# EasyEDA Pro project ProPrj_red-panda-afm_2025-05-21.epro, board PCB3
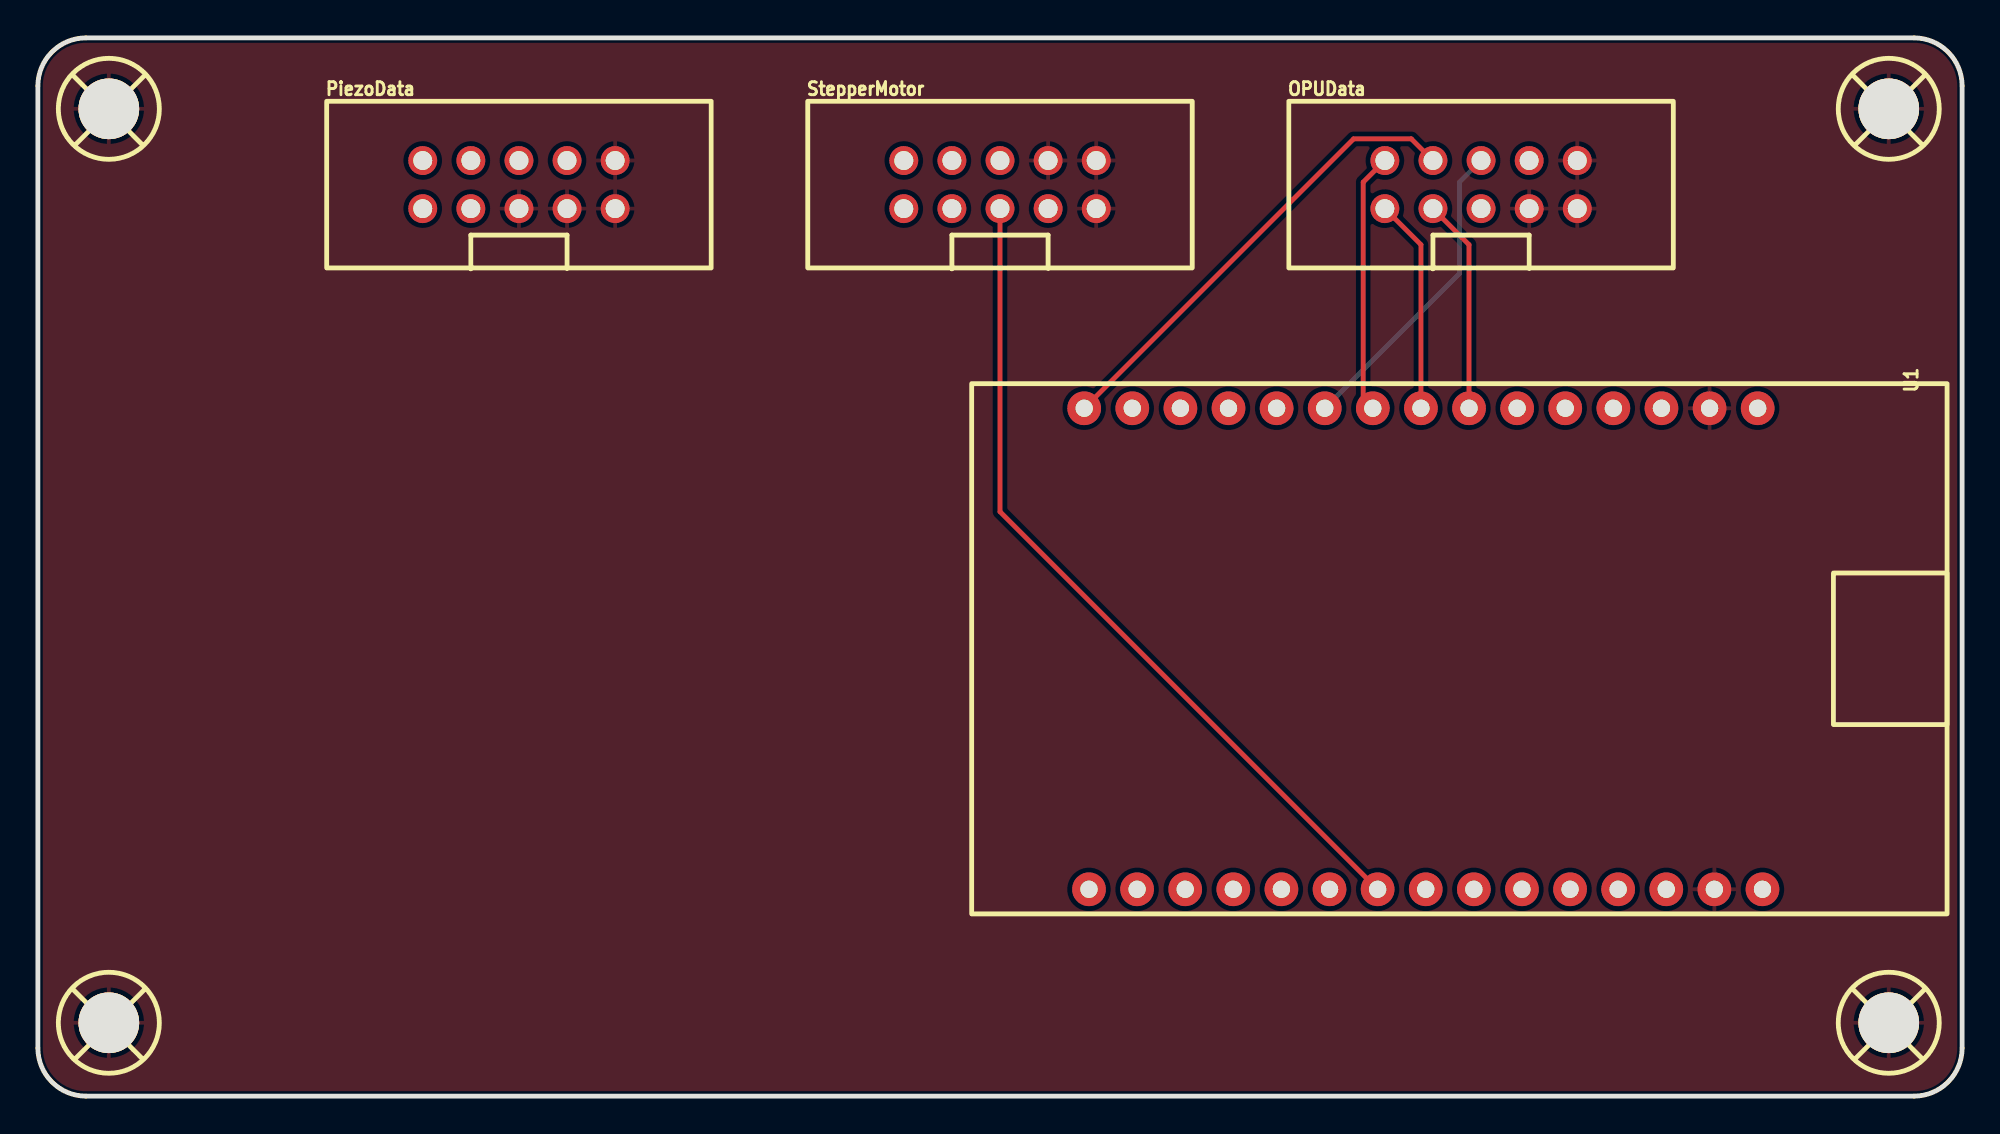
[diagram p12: board, top side]
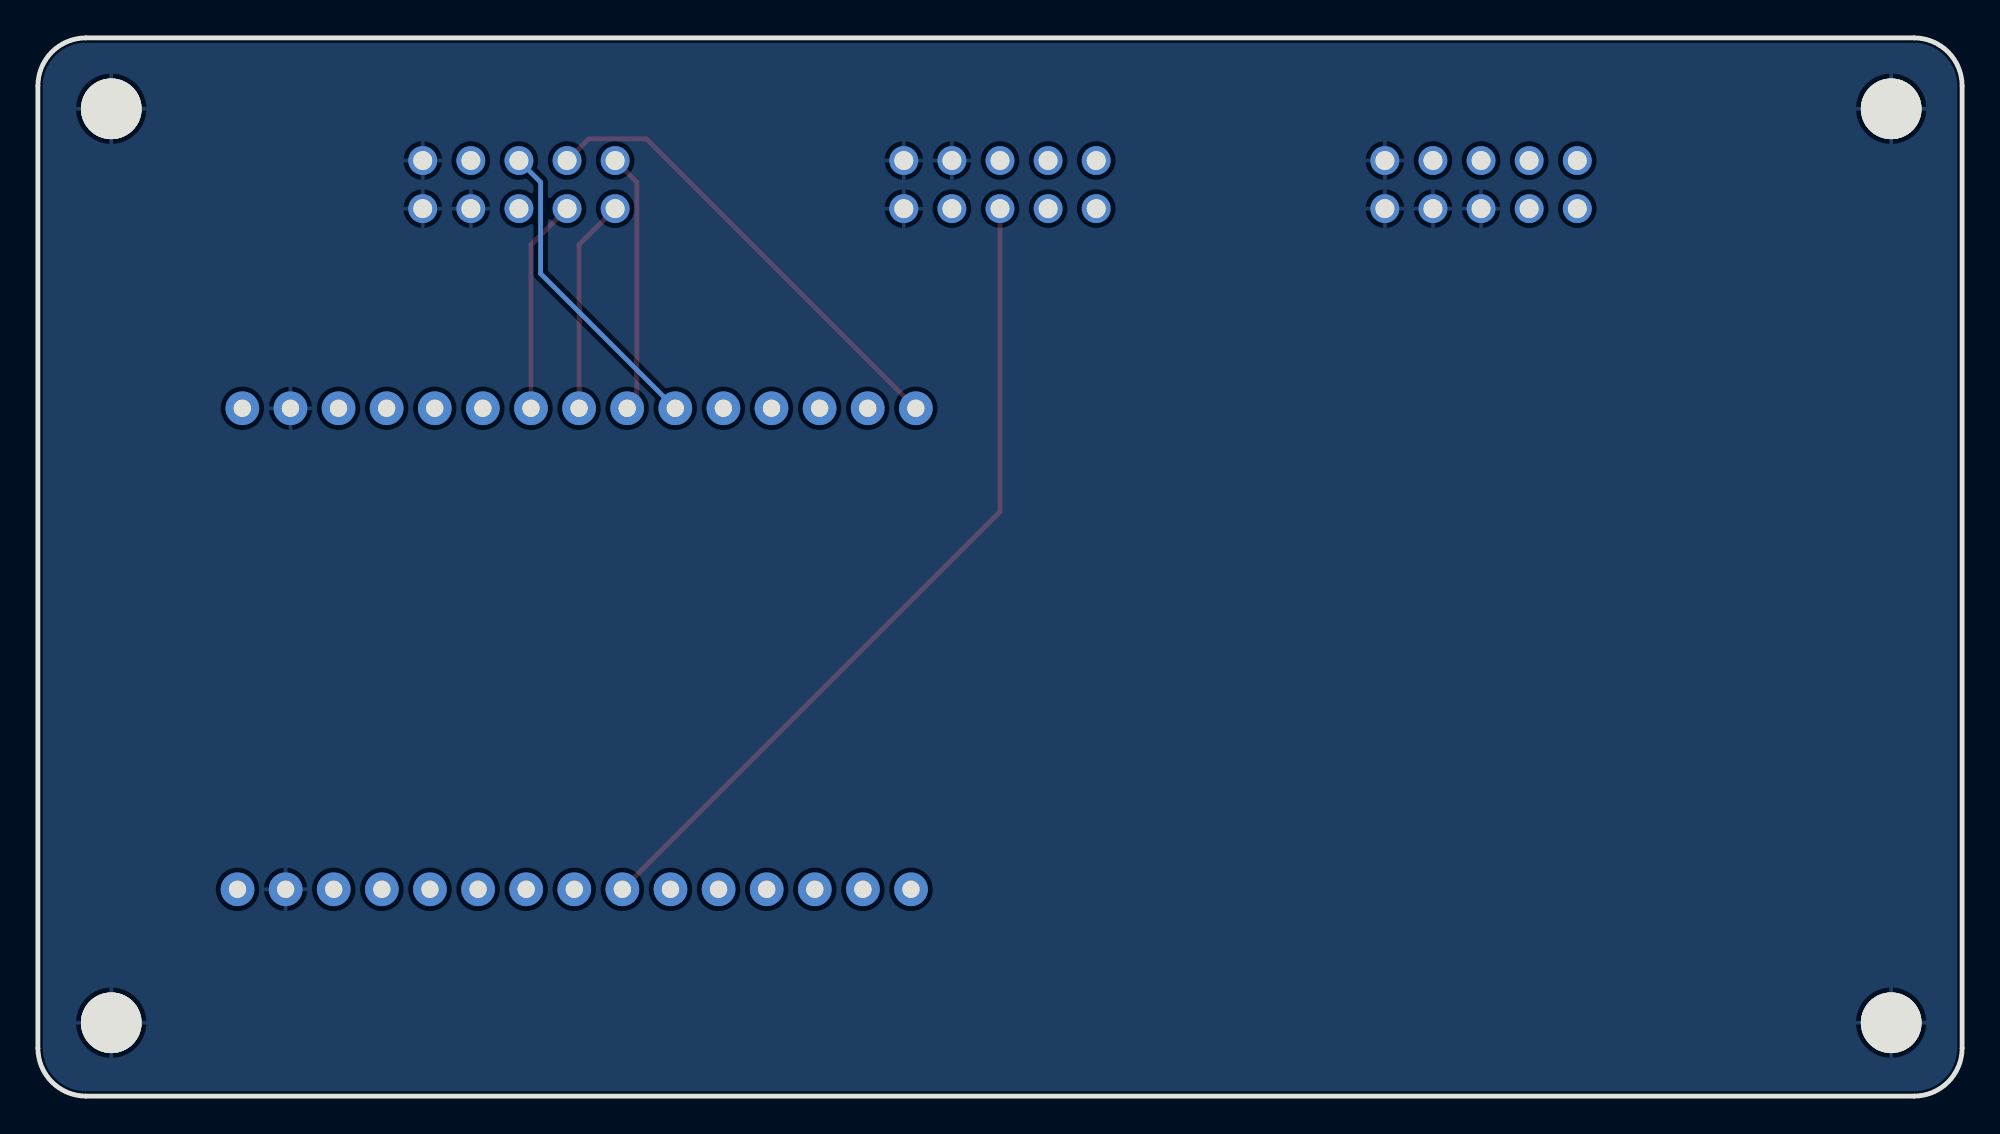
[diagram p13: board, bottom side, seen from below]

Outline 101.6 x 55.88 mm; copper layers: Top Layer, Inner1, Inner2, Bottom Layer. Coordinates in mm from the lower left corner of the outline.
Outline path: 0,53.34 0,2.54 arc(0.74,0.74) 2.54,0 99.06,0 arc(100.86,0.74) 101.6,2.54 101.6,53.34 arc(100.86,55.14) 99.06,55.88 2.54,55.88 arc(0.74,55.14) 0,53.34
Stack: Top Layer 0.035mm Outer layer copper thickness 1oz / Dielectric1 0.2104mm 7628 RC49% 8.6mil / Inner1 0.0152mm Inner layer copper thickness / Dielectric2 1.065mm 1.1mm H/HOZ Copper / Inner2 0.0152mm Inner layer copper thickness / Dielectric3 0.2104mm 7628 RC49% 8.6mil / Bottom Layer 0.035mm Outer layer copper thickness 1oz

## Design rules (mm)
template: JLCPCB Capability(Two Layers Board)
spacing copperThickness1oz (default): track to track 0.102, other pairs 0.152 to 0.3
spacing copperThickness2oz: track to track 0.203, other pairs 0.152 to 0.3
track width copperThickness1oz (default): min 0.127, default 0.254, max 2.54
track width copperThickness2oz: min 0.203, default 0.254, max 2.54
differential pair differentialPair (default): width min 0.127, default 0.254, max 2.54; gap min 0.152, default 0.152
via viaSize (default): diameter min 0.5, default 0.61, max 10; hole min 0.3, default 0.305, max 6.3

## Placement (name value [footprint] x y rotation side)
OPUData  2.54-2*5P简牛  [IDC-TH_10P-P2.54_C5665]  76.2 48.13 0 top
PiezoData  2.54-2*5P简牛  [IDC-TH_10P-P2.54_C5665]  25.4 48.13 0 top
SCREW1  -  [Screw-Hole-M3]  3.81 52.07 0 top
SCREW2  -  [Screw-Hole-M3]  97.79 52.07 0 top
SCREW3  -  [Screw-Hole-M3]  3.81 3.81 0 top
SCREW4  -  [Screw-Hole-M3]  97.79 3.81 0 top
StepperMotor  2.54-2*5P简牛  [IDC-TH_10P-P2.54_C5665]  50.8 48.13 0 top
U1  ESP32-WROOM 30-pin dev board  [ESP32-WROOM-30-DEVBOARD]  90.81 36.32 270 top

## Footprints (pads in the part's own frame, mm; a bottom-side part is the same pattern mirrored in y, then rotated)
ESP32-WROOM-30-DEVBOARD
  round 1.778 hole 0.914: 1(0,0) 2(0,-2.54) 3(0,-5.08) 4(0,-7.62) 5(0,-10.16) 6(0,-12.7) 7(0,-15.24) 8(0,-17.78) 9(0,-20.32) 10(0,-22.86) 11(0,-25.4) 12(0,-27.94) 13(0,-30.48) 14(0,-33.02) 15(0,-35.56) 16(25.4,-35.306) 17(25.4,-32.766) 18(25.4,-30.226) 19(25.4,-27.686) 20(25.4,-25.146) 21(25.4,-22.606) 22(25.4,-20.066) 23(25.4,-17.526) 24(25.4,-14.986) 25(25.4,-12.446) 26(25.4,-9.906) 27(25.4,-7.366) 28(25.4,-4.826) 29(25.4,-2.286) 30(25.4,0.254)
IDC-TH_10P-P2.54_C5665
  round 1.524 hole 1: 1(-5.08,-1.27) 2(-5.08,1.27) 3(-2.54,-1.27) 4(-2.54,1.27) 5(0,-1.27) 6(0,1.27) 7(2.54,-1.27) 8(2.54,1.27) 9(5.08,-1.27) 10(5.08,1.27)
Screw-Hole-M3
  round 3.2 hole 3.2: 1(-0.064,0.064)

## Nets
As in the schematic.

Pads without a net: U1 1 12 13 16 17 18 19 20 30

## Routing (per net, layer and track width the routed paths; a pad name or vN(x,y) marks a point on that pad's centre or on a via; arc(x,y) is an arc through that point)
ADC_CS0: length 19.5
  Inner2 w0.254: OPUData.8 77.6,48.26 76.07,48.26 75.06,47.24 75.06,45.97 U1.11
ADC_CS1: length 11.3
  Top Layer w0.254: U1.8 73.03,44.96 OPUData.1
D2: length 71.8
  Inner1 w0.254: U1.4 73.79,45.72 30.1,45.72 29.08,46.74 29.08,47.24 28.32,48.01 27.81,48.01 26.54,49.28 26.54,49.78 25.78,50.55 22.48,50.55 21.46,49.53 21.46,48.01 PiezoData.1
D4: length 62.2
  Inner1 w0.254: U1.5 71.75,45.21 24.51,45.21 PiezoData.3
D16: length 11.3
  Inner2 w0.254: 78.1,36.32 78.1,44.96 OPUData.5
D17: length 11.3
  Top Layer w0.254: U1.7 75.56,44.96 OPUData.3
D25: length 49.9
  Inner2 w0.254: U1.23 46.86,37.34 46.86,48.26 StepperMotor.2
D26: length 48.8
  Inner2 w0.254: StepperMotor.6 51.94,48.26 51.94,34.8 U1.24
D27: length 57
  Inner2 w0.254: U1.25 53.34,35.94 StepperMotor.7 53.34,47.62 52.07,48.89 52.07,49.66 51.05,50.67 50.55,50.67 48.77,48.89 ; 48.77,48.89 48.26,48.39 StepperMotor.3 ; 48.77,48.89 StepperMotor.4
D32: length 45.3
  Inner2 w0.254: StepperMotor.1 45.72,33.4 U1.21
D33: length 44.2
  Top Layer w0.254: U1.22 50.8,30.86 StepperMotor.5
HSPICLK: length 79.8
  Inner1 w0.254: PiezoData.2 19.18,48.26 19.18,46.48 30.61,35.05 56.77,35.05 U1.26
HSPICS0: length 63.5
  Inner1 w0.254: PiezoData.8 29.08,48.26 73.79,48.26 74.8,47.24 74.8,46.74 85.22,36.32 U1.3
HSPID: length 82.3
  Inner2 w0.254: PiezoData.6 27.18,51.18 53.09,51.18 54.74,49.53 54.74,44.7 61.59,37.85 61.59,35.31 U1.28
HSPIQ: length 80.7
  Inner1 w0.254: PiezoData.4 22.86,48.39 21.72,47.24 21.72,46.48 23.5,44.7 51.18,44.7 59.06,36.83 59.06,35.31 U1.27
SCLK: length 13.8
  Top Layer w0.254: OPUData.2 69.98,48.26 69.98,36.83 U1.9
SDI: length 24.8
  Top Layer w0.254: OPUData.4 72.52,50.55 69.47,50.55 U1.15
SDO: length 16.5
  Bottom Layer w0.254: U1.10 75.06,43.43 75.06,48.26 OPUData.6

## Copper pours and planes (outline as drawn; the poured copper is in the pictures)
GND on Top Layer: -5.84,64.26 120.27,64.26 120.27,-19.94 -5.84,-19.94
GND on Bottom Layer: -6.22,64.77 123.44,64.77 123.44,-19.94 -6.22,-19.94
